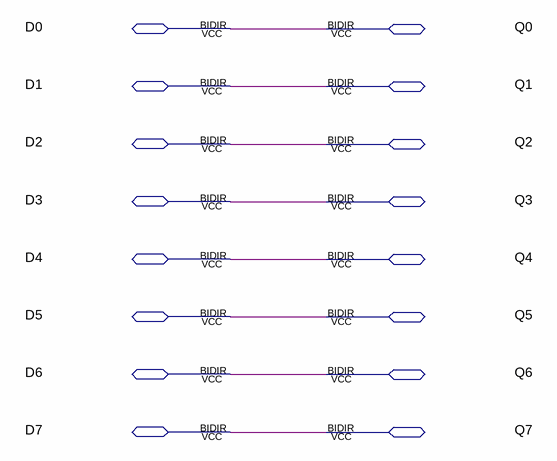
[diagram p0: schematic sheet]
// Quartus schematic 8con.bdf as structural Verilog: 0 symbols, 16 pins
module \8con  (
  inout  D0,
  inout  Q0,
  inout  D1,
  inout  Q1,
  inout  D2,
  inout  Q2,
  inout  D3,
  inout  Q3,
  inout  D4,
  inout  Q4,
  inout  D5,
  inout  Q5,
  inout  D6,
  inout  Q6,
  inout  D7,
  inout  Q7
);


  assign Q0 = D0;
  assign Q1 = D1;
  assign Q2 = D2;
  assign Q3 = D3;
  assign Q4 = D4;
  assign Q5 = D5;
  assign Q6 = D6;
  assign Q7 = D7;
endmodule
